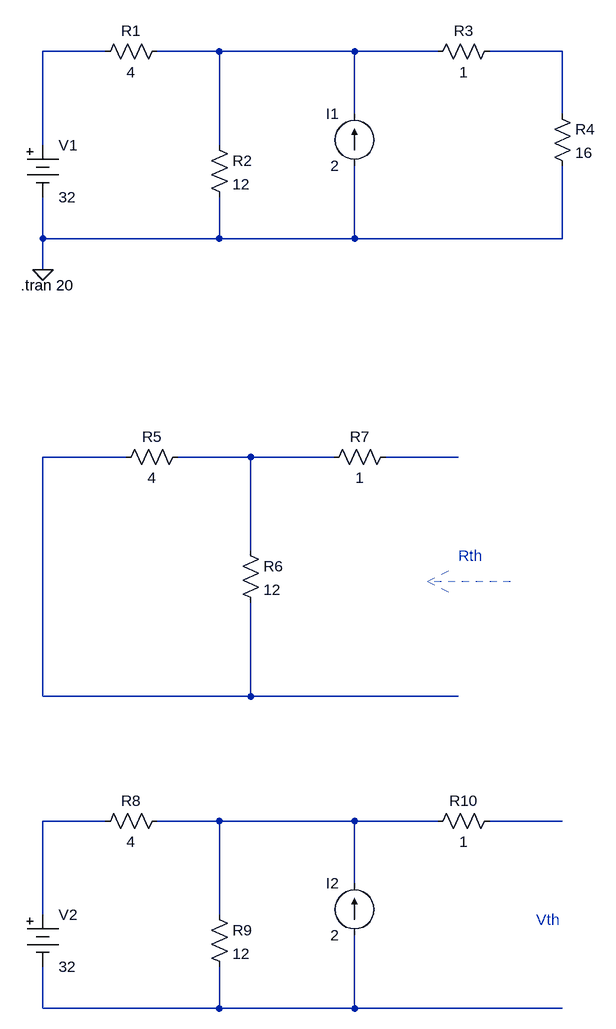
[diagram p0: schematic LAB_009_Thevenins_Theorem.asc]
LAB_009_Thevenins_Theorem.asc, the LTspice schematic file:
Version 4
SHEET 1 996 1416
WIRE 224 -144 128 -144
WIRE 400 -144 304 -144
WIRE 608 -144 400 -144
WIRE 736 -144 608 -144
WIRE 928 -144 816 -144
WIRE 608 -48 608 -144
WIRE 928 -48 928 -144
WIRE 128 0 128 -144
WIRE 400 0 400 -144
WIRE 128 144 128 80
WIRE 400 144 400 80
WIRE 400 144 128 144
WIRE 608 144 608 32
WIRE 608 144 400 144
WIRE 928 144 928 32
WIRE 928 144 608 144
WIRE 128 192 128 144
WIRE 256 480 128 480
WIRE 448 480 336 480
WIRE 576 480 448 480
WIRE 768 480 656 480
WIRE 448 624 448 480
WIRE 128 848 128 480
WIRE 448 848 448 704
WIRE 448 848 128 848
WIRE 768 848 448 848
WIRE 224 1040 128 1040
WIRE 400 1040 304 1040
WIRE 608 1040 400 1040
WIRE 736 1040 608 1040
WIRE 928 1040 816 1040
WIRE 608 1136 608 1040
WIRE 128 1184 128 1040
WIRE 400 1184 400 1040
WIRE 128 1328 128 1264
WIRE 400 1328 400 1264
WIRE 400 1328 128 1328
WIRE 608 1328 608 1216
WIRE 608 1328 400 1328
WIRE 928 1328 608 1328
FLAG 128 192 0
SYMBOL Misc\\battery 128 -16 R0
WINDOW 123 0 0 Left 0
WINDOW 39 0 0 Left 0
SYMATTR InstName V1
SYMATTR Value 32
SYMBOL res 320 -160 R90
WINDOW 0 0 56 VBottom 2
WINDOW 3 32 56 VTop 2
SYMATTR InstName R1
SYMATTR Value 4
SYMBOL res 384 -16 R0
SYMATTR InstName R2
SYMATTR Value 12
SYMBOL current 608 32 R180
WINDOW 0 24 80 Left 2
WINDOW 3 24 0 Left 2
SYMATTR InstName I1
SYMATTR Value 2
SYMBOL res 832 -160 R90
WINDOW 0 0 56 VBottom 2
WINDOW 3 32 56 VTop 2
SYMATTR InstName R3
SYMATTR Value 1
SYMBOL res 912 -64 R0
SYMATTR InstName R4
SYMATTR Value 16
SYMBOL res 352 464 R90
WINDOW 0 0 56 VBottom 2
WINDOW 3 32 56 VTop 2
SYMATTR InstName R5
SYMATTR Value 4
SYMBOL res 432 608 R0
SYMATTR InstName R6
SYMATTR Value 12
SYMBOL res 672 464 R90
WINDOW 0 0 56 VBottom 2
WINDOW 3 32 56 VTop 2
SYMATTR InstName R7
SYMATTR Value 1
SYMBOL Misc\\battery 128 1168 R0
WINDOW 123 0 0 Left 0
WINDOW 39 0 0 Left 0
SYMATTR InstName V2
SYMATTR Value 32
SYMBOL res 320 1024 R90
WINDOW 0 0 56 VBottom 2
WINDOW 3 32 56 VTop 2
SYMATTR InstName R8
SYMATTR Value 4
SYMBOL res 384 1168 R0
SYMATTR InstName R9
SYMATTR Value 12
SYMBOL current 608 1216 R180
WINDOW 0 24 80 Left 2
WINDOW 3 24 0 Left 2
SYMATTR InstName I2
SYMATTR Value 2
SYMBOL res 832 1024 R90
WINDOW 0 0 56 VBottom 2
WINDOW 3 32 56 VTop 2
SYMATTR InstName R10
SYMATTR Value 1
TEXT 94 216 Left 2 !.tran 20
TEXT 768 632 Left 2 ;Rth
TEXT 888 1192 Left 2 ;Vth
LINE Normal 848 672 720 672 2
LINE Normal 752 656 720 672 2
LINE Normal 752 688 720 672 2

The netlist it stands for:
* LAB_009_Thevenins_Theorem.asc
V1 N001 0 32
R1 N002 N001 4
R2 N002 0 12
I1 0 N002 2
R3 N003 N002 1
R4 N003 0 16
R5 N005 N004 4
R6 N005 N004 12
R7 N006 N005 1
V2 N007 N010 32
R8 N008 N007 4
R9 N008 N010 12
I2 N010 N008 2
R10 N009 N008 1
.tran 20
* Rth
* Vth
.backanno
.end